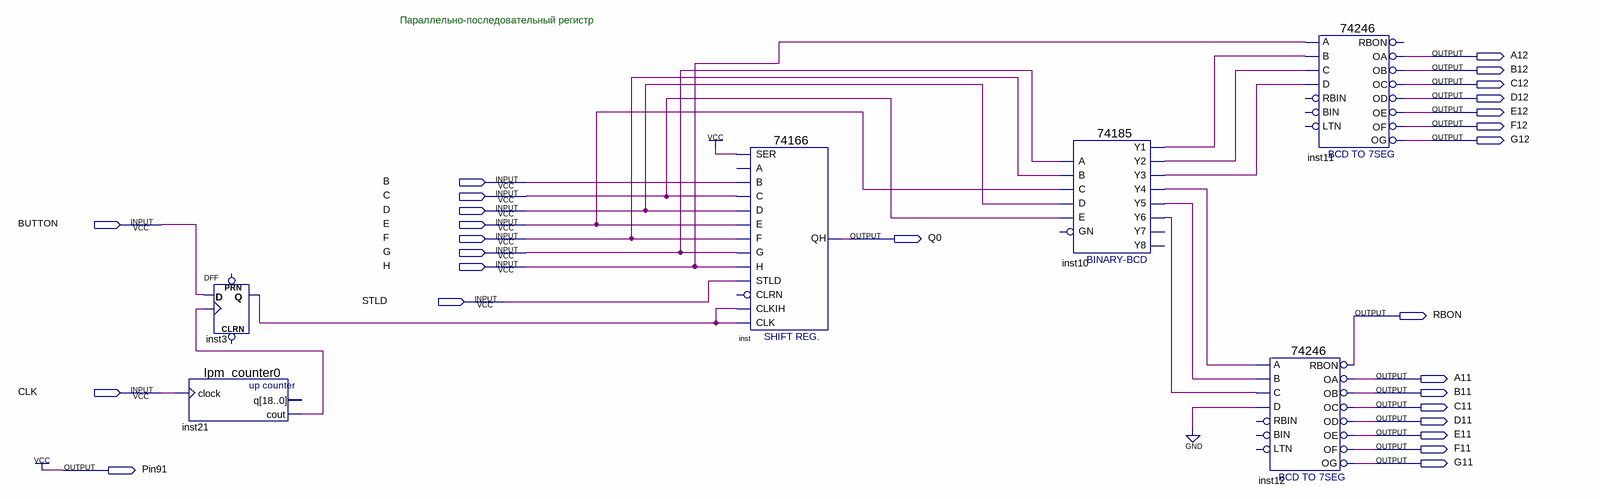
[diagram p0: schematic sheet]
// Quartus schematic Registers_3.bdf as structural Verilog: 6 symbols, 27 pins
module Registers_3 (
  input  B,
  input  C,
  input  D,
  input  BUTTON,
  input  E,
  input  F,
  input  G,
  input  H,
  input  STLD,
  input  CLK,
  output A12,
  output B12,
  output C12,
  output D12,
  output E12,
  output F12,
  output G12,
  output Q0,
  output RBON,
  output A11,
  output B11,
  output C11,
  output D11,
  output E11,
  output F11,
  output G11,
  output Pin91
);

  wire inst3_q, inst10_y1, inst10_y2, inst10_y3, inst10_y4, inst10_y5, inst10_y6, inst21_cout;

  DFF inst3 (.CLK(inst21_cout), .D(BUTTON), .Q(inst3_q));  // open: CLRN, PRN
  lpm_counter0 inst21 (.clock(CLK), .cout(inst21_cout));  // open: q
  \74166  inst (
    .SER(1'b1), .C(C), .D(D), .E(E), .B(B), .STLD(STLD), .H(H), .G(G), .F(F), .CLK(inst3_q), .CLKIH(inst3_q),
    .QH(Q0));  // open: A, CLRN
  \74185  inst10 (
    .A(G), .B(F), .D(D), .C(E), .E(C), .Y1(inst10_y1), .Y3(inst10_y3), .Y2(inst10_y2), .Y5(inst10_y5),
    .Y4(inst10_y4), .Y6(inst10_y6));  // open: GN, Y8, Y7
  \74246  inst12 (
    .B(inst10_y5), .A(inst10_y4), .D(1'b0), .C(inst10_y6), .OD(D11), .RBON(RBON), .OC(C11), .OB(B11),
    .OE(E11), .OF(F11), .OA(A11), .OG(G11));  // open: RBIN, LTN, BIN
  \74246  inst11 (
    .B(inst10_y1), .A(H), .D(inst10_y3), .C(inst10_y2), .OD(D12), .OC(C12), .OB(B12), .OE(E12), .OF(F12),
    .OA(A12), .OG(G12));  // open: RBIN, LTN, BIN, RBON

  assign Pin91 = 1'b1;

  // Notes on the sheet:
  //   Параллельно-последовательный регистр
endmodule
